# EAGLE design SparkFun_XBee_Development_Board (EAGLE 9.6.2)
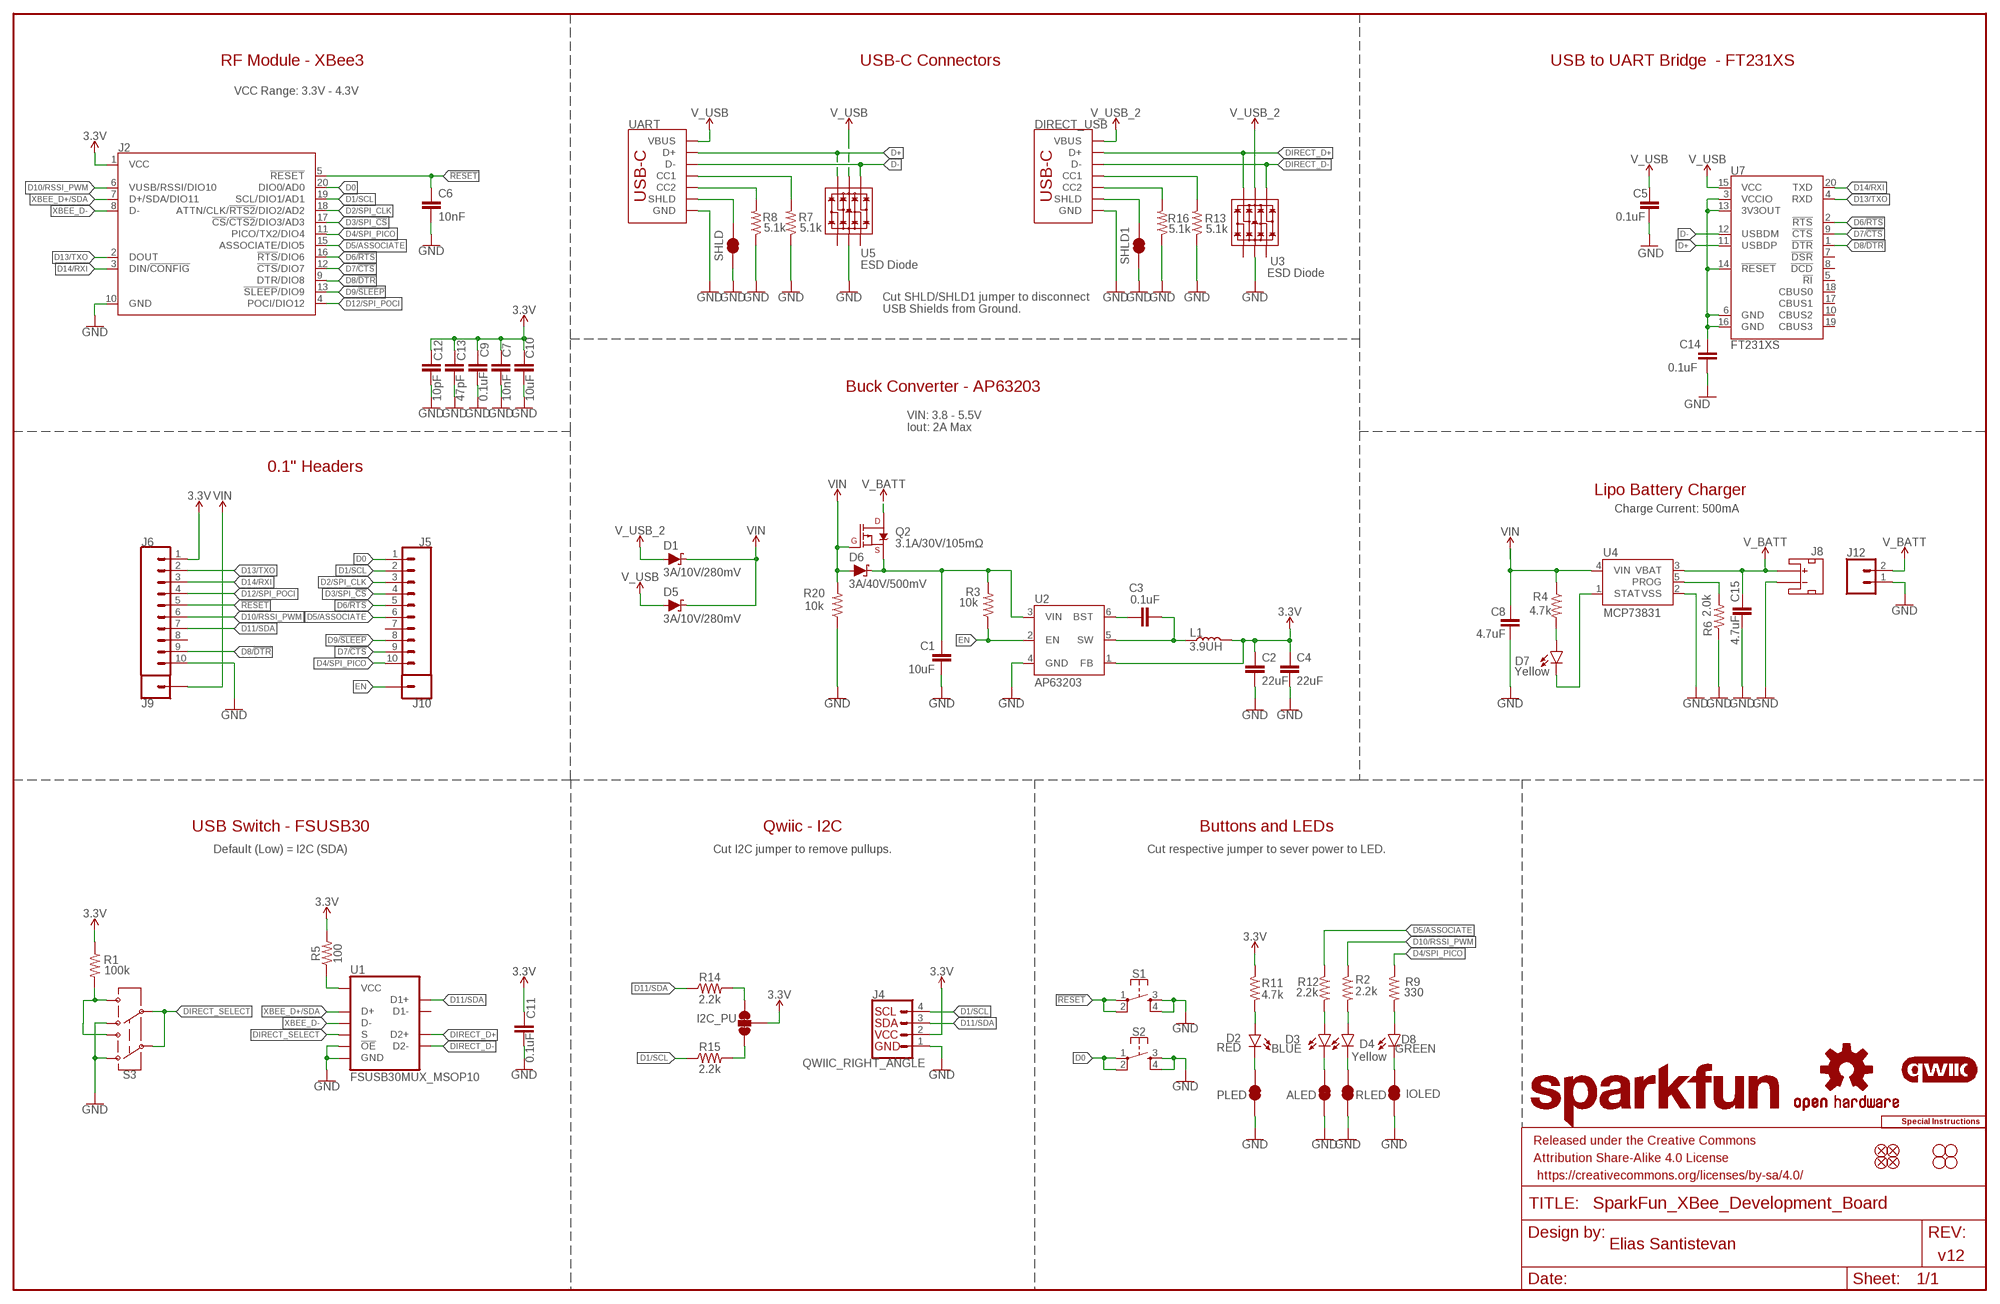
[diagram p0: schematic, sheet 1]

## Parts
ALED  JUMPER-SMT_2_NC_TRACE_SILK  [SMT-JUMPER_2_NC_TRACE_SILK]
C1  10uF  10UF-1210-50V-20%  [1210]
C2  22uF  22UF-0603-6.3V-20%  [0603]
C3  0.1uF  0.1UF-0603-25V-5%  [0603]
C4  22uF  22UF-0603-6.3V-20%  [0603]
C5  0.1uF  0.1UF-0603-25V-(+80/-20%)  [0603]
C6  10nF  10NF-0603-50V-10%  [0603]
C7  10nF  10NF-0603-50V-10%  [0603]
C8  4.7uF  4.7UF-0603-6.3V-(10%)  [0603]
C9  0.1uF  0.1UF-0603-25V-(+80/-20%)  [0603]
C10  10uF  10UF-0603-6.3V-20%  [0603]
C11  0.1uF  0.1UF-0603-25V-(+80/-20%)  [0603]
C12  10pF  10PF-0603-50V-5%  [0603]
C13  47pF  47PF-0603-50V-5%  [0603]
C14  0.1uF  0.1UF-0603-25V-(+80/-20%)  [0603]
C15  4.7uF  4.7UF-0603-35V-(20%)  [0603]
D1  3A/10V/280mV  DIODE-SCHOTTKY-BAT60A  [SOD-323]
D2  RED  LED-RED_0603-KB  [LED-0603]
D3  BLUE  LED-BLUE0603  [LED-0603]
D4  Yellow  LED-YELLOW0603  [LED-0603]
D5  3A/10V/280mV  DIODE-SCHOTTKY-BAT60A  [SOD-323]
D6  3A/40V/500mV  DIODE-SCHOTTKY-B340A  [SMA-DIODE]
D7  Yellow  LED-YELLOW0603  [LED-0603]
D8  GREEN  LED-GREEN0603  [LED-0603]
DIRECT_USB  USB Female Type C Connector  USB_C_4-LAYER-ISOLATED  [USB-C-16P-4LAYER-ISOLATED]
FD1  FIDUCIAL1X2  [FIDUCIAL-1X2]
FD2  FIDUCIAL1X2  [FIDUCIAL-1X2]
FD3  FIDUCIAL1X2  [FIDUCIAL-1X2]
FD4  FIDUCIAL1X2  [FIDUCIAL-1X2]
FRAME1  FRAME-LEDGER  [CREATIVE_COMMONS]
H1  STAND-OFFTIGHT  [STAND-OFF-TIGHT]
H2  STAND-OFFTIGHT  [STAND-OFF-TIGHT]
H3  STAND-OFFTIGHT  [STAND-OFF-TIGHT]
H4  STAND-OFFTIGHT  [STAND-OFF-TIGHT]
I2C_PU  JUMPER-SMT_3_2-NC_TRACE_SILK  [SMT-JUMPER_3_2-NC_TRACE_SILK]
IOLED  JUMPER-SMT_2_NC_TRACE_SILK  [SMT-JUMPER_2_NC_TRACE_SILK]
J2  XBEE_UPDATEXBEE_SMD  [XBEE3-SMD]
J4  QWIIC_RIGHT_ANGLE  QWIIC_CONNECTORJS-1MM  [JST04_1MM_RA]
J5  CONN_10NO_SILK_PTH_FEMALE  [1X10_NO_SILK]
J6  CONN_10NO_SILK_PTH_FEMALE  [1X10_NO_SILK]
J8  JST_2MM_MALE  [JST-2-SMD]
J9  CONN_01PTH_NO_SILK_STAND  [1X01_NO_SILK_STAND]
J10  CONN_01PTH_NO_SILK_STAND  [1X01_NO_SILK_STAND]
J12  CONN_021X02_NO_SILK  [1X02_NO_SILK]
L1  3.9UH  [INDUCTOR_3.9UH]
LOGO1  SFE_LOGO_NAME.2_INCH  [SFE_LOGO_NAME_.2]
LOGO2  OSHW-LOGOS  [OSHW-LOGO-S]
LOGO3  QWIIC_LOGO_5MM  [QWIIC_5MM]
LOGO5  SPECIAL_INSTRUCTIONS-ORDERING  [ORDERING_INSTRUCTIONS]
PLED  JUMPER-SMT_2_NC_TRACE_SILK  [SMT-JUMPER_2_NC_TRACE_SILK]
Q2  3.1A/30V/105mΩ  MOSFET_PCH-DMG2307L  [SOT23-3]
R1  100k  100KOHM-0603-1/10W-1%  [0603]
R2  2.2k  2.2KOHM-0603-1/10W-1%  [0603]
R3  10k  10KOHM-0603-1/10W-1%  [0603]
R4  4.7k  4.7KOHM-0603-1/10W-1%  [0603]
R5  100  100OHM-0603-1/10W-1%  [0603]
R6  2.0k  2.0KOHM-0603-1/10W-5%  [0603]
R7  5.1k  5.1KOHM5.1KOHM-0603-1/10W-1%  [0603]
R8  5.1k  5.1KOHM5.1KOHM-0603-1/10W-1%  [0603]
R9  330  330OHM-0603-1/10W-1%  [0603]
R11  4.7k  4.7KOHM-0603-1/10W-1%  [0603]
R12  2.2k  2.2KOHM-0603-1/10W-1%  [0603]
R13  5.1k  5.1KOHM5.1KOHM-0603-1/10W-1%  [0603]
R14  2.2k  2.2KOHM-0603-1/10W-1%  [0603]
R15  2.2k  2.2KOHM-0603-1/10W-1%  [0603]
R16  5.1k  5.1KOHM5.1KOHM-0603-1/10W-1%  [0603]
R20  10k  10KOHM-0603-1/10W-1%  [0603]
RLED  JUMPER-SMT_2_NC_TRACE_SILK  [SMT-JUMPER_2_NC_TRACE_SILK]
S1  MOMENTARY-SWITCH-SPST-2-SMD-5.2MM-TALL  [TACTILE_SWITCH_SMD_5.2MM]
S2  MOMENTARY-SWITCH-SPST-2-SMD-5.2MM-TALL  [TACTILE_SWITCH_SMD_5.2MM]
S3  SWITCH-DPDT-SMD-AYZ0202  [SWITCH_DPDT_SMD_AYZ0202]
SHLD  JUMPER-SMT_2_NC_TRACE_SILK  [SMT-JUMPER_2_NC_TRACE_SILK]
SHLD1  JUMPER-SMT_2_NC_TRACE_SILK  [SMT-JUMPER_2_NC_TRACE_SILK]
U1  FSUSB30MUX_MSOP10  [MSOP10]
U2  AP63203  [SOT23-6]
U3  ESD Diode  TVS_DIODE_ARRAY_DT1042-04SO-7  [SOT-23-6]
U4  MCP73831  [SOT23-5]
U5  ESD Diode  TVS_DIODE_ARRAY_DT1042-04SO-7  [SOT-23-6]
U7  FT231XS  [SSOP20_L]
UART  USB Female Type C Connector  USB_C_4-LAYER-ISOLATED  [USB-C-16P-4LAYER-ISOLATED]

## Nets
3.3V: C2.1 C4.1 C7.1 C9.1 C10.1 C11.1 C12.1 C13.1 I2C_PU.2 J2.1(VCC) J4.2 J6.1 L1.P$2 R1.1 R5.2 R11.1 U2.1(FB)
!RESET!: C6.1 J2.5(!RESET!) J6.5 S1.1 S1.2
ALED: ALED.2 D3.C
D0: J2.20(DIO0/AD0) J5.1 S2.1 S2.2
D1/SCL: J2.19(SCL/DIO1/AD1) J4.4 J5.2 R15.1
D2/SPI_CLK: J2.18(ATTN/CLK/!RTS2!/DIO2/AD2) J5.3
D3/SPI_!CS!: J2.17(!CS!/!CTS2!/DIO3/AD3) J5.4
D4/SPI_PICO: J2.11(PICO/TX2/DIO4) J5.10 R9.1
D5/ASSOCIATE: J2.15(ASSOCIATE/DIO5) J5.6 R12.1
D6/!RTS!: J2.16(!RTS!/DIO6) J5.5 U7.2(!RTS)
D7/!CTS!: J2.12(!CTS!/DIO7) J5.9 U7.9(!CTS)
D8/!DTR!: J2.9(DTR/DIO8) J6.9 U7.1(!DTR)
D9/!SLEEP!: J2.13(!SLEEP!/DIO9) J5.8
D10/RSSI_PWM: J2.6(VUSB/RSSI/DIO10) J6.6 R2.1
D11/SDA: J4.3 J6.7 R14.1 U1.2(D1+)
D12/SPI_POCI: J2.4(POCI/DIO12) J6.4
D13/TXO: J2.2(DOUT) J6.2 U7.4(RXD)
D14/RXI: J2.3(DIN/!CONFIG!) J6.3 U7.20(TXD)
D+ [Diff pairs]: U5.6(IO4) U7.11(USBDP) UART.A6(D+) UART.B6(D+)
D- [Diff pairs]: U5.4(IO3) U7.12(USBDM) UART.A7(D-) UART.B7(D-)
DIRECT_D+ [Diff pairs]: DIRECT_USB.A6(D+) DIRECT_USB.B6(D+) U1.3(D2+) U3.6(IO4)
DIRECT_D- [Diff pairs]: DIRECT_USB.A7(D-) DIRECT_USB.B7(D-) U1.7(D2-) U3.4(IO3)
DIRECT_SELECT: S3.2 S3.5 U1.1(S)
EN: J10.1 R3.1 U2.2(EN)
FIRMWARE: R1.2 S3.1 S3.4
GND: ALED.1 C1.2 C2.2 C4.2 C5.2 C6.2 C7.2 C8.2 C9.2 C10.2 C11.2 C12.2 C13.2 C14.2 C15.2 DIRECT_USB.GND DIRECT_USB.GND2(GND) IOLED.1 J2.10(GND) J4.1 J6.10 J8.1(-) J12.1 PLED.1 R6.1 R7.1 R8.1 R13.1 R16.1 R20.1 RLED.1 S1.3 S1.4 S2.3 S2.4 S3.3 S3.6 SHLD1.1 SHLD.1 U1.5(GND) U1.9(!OE!) U2.4(GND) U3.2(VSS) U4.2(VSS) U5.2(VSS) UART.GND UART.GND2(GND)
IOLED: D8.C IOLED.2
N$1: C3.1 U2.6(BST)
N$2: D4.A R2.2
N$3: R5.1 U1.10(VCC)
N$4: R8.2 UART.B5(CC2)
N$5: R7.2 UART.A5(CC1)
N$6: R6.2 U4.5(PROG)
N$7: D2.A R11.2
N$8: C3.2 L1.P$1 U2.5(SW)
N$9: D7.C U4.1(STAT)
N$10: D7.A R4.2
N$11: I2C_PU.3 R14.2
N$12: D3.A R12.2
N$13: I2C_PU.1 R15.2
N$14: DIRECT_USB.B5(CC2) R16.2
N$15: C1.1 D6.C Q2.2(S) R3.2 U2.3(VIN)
N$16: DIRECT_USB.A5(CC1) R13.2
N$17: D8.A R9.2
N$18: C14.1 U7.3(VCCIO) U7.6(GND) U7.13(3V3OUT) U7.14(!RESET) U7.16(GND)
PLED: D2.C PLED.2
RLED: D4.C RLED.2
SHLD: SHLD.2 UART.SHLD1(SHLD) UART.SHLD2(SHLD) UART.SHLD3(SHLD) UART.SHLD4(SHLD) UART.SHLD5(SHLD) UART.SHLD6(SHLD) UART.SHLD7(SHLD) UART.SHLD8(SHLD)
SHLD1: DIRECT_USB.SHLD1(SHLD) DIRECT_USB.SHLD2(SHLD) DIRECT_USB.SHLD3(SHLD) DIRECT_USB.SHLD4(SHLD) DIRECT_USB.SHLD5(SHLD) DIRECT_USB.SHLD6(SHLD) DIRECT_USB.SHLD7(SHLD) DIRECT_USB.SHLD8(SHLD) SHLD1.2
V_BATT [POWER]: C15.1 J8.2(+) J12.2 Q2.3(D) U4.3(VBAT)
V_USB: C5.1 D5.A U5.5(VCC) U7.15(VCC) UART.VBUS1(VBUS) UART.VBUS2(VBUS)
V_USB_2: D1.A DIRECT_USB.VBUS1(VBUS) DIRECT_USB.VBUS2(VBUS) U3.5(VCC)
VIN: C8.1 D1.C D5.C D6.A J9.1 Q2.1(G) R4.1 R20.2 U4.4(VIN)
XBEE_D+/SDA [Diff pairs]: J2.7(D+/SDA/DIO11) U1.4(D+)
XBEE_D- [Diff pairs]: J2.8(D-) U1.6(D-)
Unconnected: J5.7 J6.8 J8.NC1(PAD1) J8.NC2(PAD2) U1.8(D1-) U3.1(IO1) U3.3(IO2) U5.1(IO1) U5.3(IO2) U7.5(!RI) U7.7(!DSR) U7.8(!DCD) U7.10(CBUS2) U7.17(CBUS1) U7.18(CBUS0) U7.19(CBUS3)

## Notes on the sheet
- RF Module - XBee3 | USB-C Connectors | USB to UART Bridge  - FT231XS
- VCC Range: 3.3V - 4.3V
- Cut SHLD/SHLD1 jumper to disconnect
  USB Shields from Ground.
- Buck Converter - AP63203
- VIN: 3.8 - 5.5V
  Iout: 2A Max
- 0.1" Headers
- Lipo Battery Charger
- Charge Current: 500mA
- USB Switch - FSUSB30 | Qwiic - I2C | Buttons and LEDs
- Default (Low) = I2C (SDA) | Cut I2C jumper to remove pullups. | Cut respective jumper to sever power to LED.
- Elias Santistevan
- v12

## Library data of the parts
ALED IOLED PLED RLED SHLD SHLD1 = SparkFun-Jumpers:JUMPER-SMT_2_NC_TRACE: Normally closed trace jumper This jumper has a trace between two pads so it's normally closed (NC). Use a razor knife to open the connection. For best results follow the IPC guidelines for cutting traces: Cutout at least 0.063 mm (0.005 in). Remove all loose material to clean up the cut area. Seal the cut with an approved epoxy. Reapply solder to reclose the connection.
C1 = SparkFun-Capacitors:10UF: 10.0µF ceramic capacitors A capacitor is a passive two-terminal electrical component used to store electrical energy temporarily in an electric field.; PROD_ID: CAP-09824
C2 C4 = SparkFun-Capacitors:22UF: 22µF ceramic capacitors A capacitor is a passive two-terminal electrical component used to store electrical energy temporarily in an electric field.; PROD_ID: CAP-14464
C3 = SparkFun-Capacitors:0.1UF: 0.1µF ceramic capacitors A capacitor is a passive two-terminal electrical component used to store electrical energy temporarily in an electric field.; PROD_ID: CAP-08604
C5 C9 C11 C14 = SparkFun-Capacitors:0.1UF: 0.1µF ceramic capacitors A capacitor is a passive two-terminal electrical component used to store electrical energy temporarily in an electric field.; PROD_ID: CAP-00810
C6 C7 = SparkFun-Capacitors:10NF: 0.01uF/10nF/10,000pF ceramic capacitors A capacitor is a passive two-terminal electrical component used to store electrical energy temporarily in an electric field. CAP-09321; PROD_ID: CAP-00867
C8 = SparkFun-Capacitors:4.7UF: 4.7µF ceramic capacitors A capacitor is a passive two-terminal electrical component used to store electrical energy temporarily in an electric field.; PROD_ID: CAP-08280
C10 = SparkFun-Capacitors:10UF: 10.0µF ceramic capacitors A capacitor is a passive two-terminal electrical component used to store electrical energy temporarily in an electric field.; PROD_ID: CAP-11015
C12 = SparkFun-Capacitors:10PF: 10pF ceramic capacitors A capacitor is a passive two-terminal electrical component used to store electrical energy temporarily in an electric field.; PROD_ID: CAP-11812
C13 = SparkFun-Capacitors:47PF: 47pF ceramic capacitors A capacitor is a passive two-terminal electrical component used to store electrical energy temporarily in an electric field.; PROD_ID: CAP-08913
C15 = SparkFun-Capacitors:4.7UF: 4.7µF ceramic capacitors A capacitor is a passive two-terminal electrical component used to store electrical energy temporarily in an electric field.; PROD_ID: CAP-14106
D1 D5 = SparkFun-DiscreteSemi:DIODE-SCHOTTKY: Schottky diode A Schottky diode is a semiconductor diode which has a low forward voltage drop and a very fast switching action.; PROD_ID: DIO-14072
D2 = SparkFun-LED:LED-RED: Red SMD LED Used in manufacturing of most products at SparkFun Packages: 0603 - KB - KingBright (DIO-17976) SMD 0603 package [Datasheet] <https://www.kingbrightusa.com/images/catalog/SPEC/APT1608SURCK.pdf> 0603 - (DIO-00819, has gone EOL) SMD 0603 package 0603 SMART - SMD 0603 SMART package ( more efficient and expensive)[Product Link] <http://www.osram-os.com/Graphics/XPic2/00077099_0.pdf> 1206 - SMD1206 package [Product Link] <https://www.sparkfun.com/datasheets/DevTools/LilyPad/Q150OVS4.pdff> SparkFun Products: Pro Mini 328 -5V <https://www.sparkfun.com/products/821> RedBoard <https://www.sparkfun.com/products/12757> IOIO-OTG <https://www.sparkfun.com/products/13613>; PROD_ID: DIO-17976
D3 = SparkFun-LED:LED-BLUE: Blue SMD LED Used in manufacturing of various products at SparkFun Packages: 0603 - SMD 0603 package [Product Link] <http://www.digikey.com/product-detail/en/SMLE12BC7TT86/511-1589-2-ND/1641808> 1206 - SMD1206 package [Product Link] <http://www.digikey.com/product-detail/en/lite-on-inc/LTST-C150TBKT/160-1643-1-ND/573584> SparkFun Products: ESP8266 Thing-Dev Board <https://www.sparkfun.com/products/13711> RedBoard <https://www.sparkfun.com/products/12757>; PROD_ID: DIO-08575
D4 D7 = SparkFun-LED:LED-YELLOW: Yellow SMD LED Used in manufacturing several products at SparkFun. Packages: 0603 - SMD 0603 package[Product Link] <http://www.kingbrightusa.com/product.asp?catalog_name=LED&product_id=APT1608SYCK> 0603 -SMART - SMART SMD 0603 package (more efficient/more expensive) [Product Link] <http://www.osram-os.com/osram_os/en/products/product-catalog/led-light-emitting-diodes/smartled-0603/ly-l29k/index.jsp> LilyPad - SMD1206 package[Product Datasheet] <https://www.sparkfun.com/datasheets/DevTools/LilyPad/Q150YUS4.pdf> SparkFun Products: Blynk Board <https://www.sparkfun.com/products/13794> IOIO-OTG <https://www.sparkfun.com/products/13613> XBee Explorer Serial <https://www.sparkfun.com/products/13225>; PROD_ID: DIO-09003
D6 = SparkFun-DiscreteSemi:DIODE-SCHOTTKY: Schottky diode A Schottky diode is a semiconductor diode which has a low forward voltage drop and a very fast switching action.; PROD_ID: DIO-09886
D8 = SparkFun-LED:LED-GREEN: Green SMD LED Used in manufacturing of various products at SparkFun Packages: 0603 - SMD 0603 package [Product Link] <http://www.futureelectronics.com/en/technologies/semiconductors/optoelectronics/leds/Pages/9894312-LTST-C190GKT.aspx?CrossPart=HSMG-C190&IM=0> LilyPad 1206 - SMD1206 LilyPad package [Product Link] <http://www.futureelectronics.com/en/Technologies/Product.aspx?ProductID=IN150NGHARVATEKCORPORATION2049943&IM=0> 1206 - SMD1206 package [Product Link] <http://www.futureelectronics.com/en/technologies/semiconductors/optoelectronics/leds/Pages/8315665-LTST-C150KGKT.aspx?IM=0> 1206 Bottom Mount -SMD 1206 Bottom Mount [Product Link] <http://www.digikey.com/product-detail/en/lite-on-inc/LTST-C230KGKT/160-1456-1-ND/386854> SparkFun Products: Pro Mini 328 -5V <https://www.sparkfun.com/products/821> RedBoard <https://www.sparkfun.com/products/12757> MP3 Trigger <https://www.sparkfun.com/products/13720> Makey Makey <https://www.sparkfun.com/products/11076>; PROD_ID: DIO-00821
DIRECT_USB UART = SparkFun-Connectors:USB_C: USB Type C 16Pin Connector Super Speed pins not available on the 16-pin purely SMD connector so this part is best for USB 2.0 implementations. D1 and D2 are tied together enabling D+/- no matter which way the cable is plugged into the connector. The two channel configuration pins (CC1/2) are exposed. These are normally connected to ground via 5.1k resistors but can be reconfigured for high current/high power applications. **4-LAYER BOARD WARNING!!** If designing 4-layer board, make sure to select the variant _4-LAYER-ISOLATED. The linked footprint (USB-C-16-4LAYER-ISOLATED) includes some very necessary cutout polygons in the inner layers (2 and 15). This prevents the PTH mounting shield legs on the USB connector from electrically connecting any other polygons on the inner layers (usually VCC and GND).; PROD_ID: CONN-14122
FD1-FD4 = SparkFun-Aesthetics:FIDUCIAL: Fiducial Alignment Points Point-of-reference for pick-and-place machines and other optical instruments.
FRAME1 = SparkFun-Aesthetics:FRAME-LEDGER: Schematic Frame - Ledger Standard 11x14 US Ledger frame
H1-H4 = SparkFun-Hardware:STAND-OFF: Stand Off Drill holes for mechanically mounting via screws, standoffs, etc. Note: Use the keepout ring to avoid running the screw head into surrounding components. Variant Overviews STAND-OFF - Mechanical footprint for a #4 phillips button head screw. STAND-OFF-TIGHT - Mechanical footprint for a #4 phillips button head screw, Example SparkFun Products Screw - Phillips Head (1/4", 4-40, 10 pack) <https://www.sparkfun.com/products/10453> (PRT-10453) Screw - Phillips Head (1/2", 4-40, 10 pack) <https://www.sparkfun.com/products/10452> (PRT-10452) Screw - Phillips Head (3/4", 4-40, 10 pack) <https://www.sparkfun.com/products/10451> (PRT-10451) Screw - Phillips Head (1", 4-40, 10 pack) <https://www.sparkfun.com/products/10450> (PRT-10450)
I2C_PU = SparkFun-Jumpers:JUMPER-SMT_3_2-NC_TRACE: Normally closed trace jumper (2 of 2 connections) This jumper has a trace between all three pads so they are normally closed (NC). Use a razor knife to open the connection(s). For best results follow the IPC guidelines for cutting traces: Cutout at least 0.063 mm (0.005 in). Remove all loose material to clean up the cut area. Seal the cut with an approved epoxy. Reapply solder to reclose the connection(s).
J2 = xbee_smart_modem:XBEE_UPDATE: XBee 3 Cat 1 Smart Modem
J4 = SparkFun-Connectors:QWIIC_CONNECTOR: SparkFun I2C Standard Qwiic Connector An SMD 1mm pitch JST connector makes it easy and quick (get it? Qwiic?) to connect I2C devices to each other. The Qwiic system <http://www.sparkfun.com/qwiic> enables fast and solderless connection between popular platforms and various sensors and actuators. We carry 200mm <https://www.sparkfun.com/products/14204>, 100mm <https://www.sparkfun.com/products/14205>, 50mm <https://www.sparkfun.com/products/14206>, and breadboard friendly <https://www.sparkfun.com/products/14207> Qwiic cables. We also offer 10 pcs strips <https://www.sparkfun.com/products/14323> the SMD connectors.; PROD_ID: CONN-13694
J5 J6 = SparkFun-Connectors:CONN_10: Multi connection point. Often used as Generic Header-pin footprint for 0.1 inch spaced/style header connections On any of the 0.1 inch spaced packages, you can populate with these: Break Away Headers - Straight <https://www.sparkfun.com/products/116> (PRT-00116) Break Away Male Headers - Right Angle <https://www.sparkfun.com/products/553> (PRT-00553) Female Headers <https://www.sparkfun.com/products/115> (PRT-00115) Break Away Headers - Machine Pin <https://www.sparkfun.com/products/117> (PRT-00117) Break Away Female Headers - Swiss Machine Pin <https://www.sparkfun.com/products/743> (PRT-00743) Arduino Stackable Header - 10 Pin <https://www.sparkfun.com/products/11376> (PRT-11376) For SCREWTERMINALS and SPRING TERMINALS visit here: Screw Terimnals on SparkFun.com <https://www.sparkfun.com/search/results?term=Screw+Terminals> (5mm/3.5mm/2.54mm spacing) This device is also useful as a general connection point to wire up your design to another part of your project. Our various solder wires solder well into these plated through hole pads. Hook-Up Wire - Assortment (Stranded, 22 AWG) <https://www.sparkfun.com/products/11375> (PRT-11375) Hook-Up Wire - Assortment (Solid Core, 22 AWG) <https://www.sparkfun.com/products/11367> (PRT-11367) View the entire wire category on our website here <https://www.sparkfun.com/categories/141> Special notes: Molex polarized connector foot print use with SKU : PRT-08231 with associated crimp pins and housings. 1MM SMD Version SKU: PRT-10208 NOTES ON THE VARIANTS LOCK and LOCK_LONGPADS... This footprint was designed to help hold the alignment of a through-hole component (i.e. 6-pin header) while soldering it into place. You may notice that each hole has been shifted either up or down by 0.005 of an inch from it's more standard position (which is a perfectly straight line). This slight alteration caused the pins (the squares in the middle) to touch the edges of the holes. Because they are alternating, it causes a "brace" to hold the component in place. 0.005 has proven to be the perfect amount of "off-center" position when using our standard breakaway headers. Although looks a little odd when you look at the bare footprint, once you have a header in there, the alteration is very hard to notice. Also,if you push a header all the way into place, it is covered up entirely on the bottom side.
J8 = SparkFun-Connectors:JST_2MM_MALE: JST 2MM MALE RA CONNECTOR Two pin, compact surface mount connector. Commonly used as a battery input connection point. We really like the solid locking feeling and high current rating on these small connectors. We use these all the time as battery connectors. Mates to single-cell LiPo batteries. Here is the connector we sell at SparkFun: JST Right Angle Connector - White <https://www.sparkfun.com/products/8612> (PRT-08612) Datasheet <http://www.sparkfun.com/datasheets/Prototyping/Connectors/JST-Horizontal.pdf> It was used on these SparkFun products: SparkFun MOSFET Power Controller <https://www.sparkfun.com/products/11214> (PRT-11214) SparkFun Battery Babysitter - LiPo Battery Manager <https://www.sparkfun.com/products/13777> (PRT-13777) And many, many others that required a lipo battery connection.; PROD_ID: CONN-11443; SF_ID: PRT-08612
J9 J10 = SparkFun-Connectors:CONN_01: Single connection point. Often used as Generic Header-pin footprint for 0.1 inch spaced/style header connections On any of the 0.1 inch spaced packages, you can populate with these: Break Away Headers - Straight <https://www.sparkfun.com/products/116> (PRT-00116) Break Away Male Headers - Right Angle <https://www.sparkfun.com/products/553> (PRT-00553) Female Headers <https://www.sparkfun.com/products/115> (PRT-00115) Break Away Headers - Machine Pin <https://www.sparkfun.com/products/117> (PRT-00117) Break Away Female Headers - Swiss Machine Pin <https://www.sparkfun.com/products/743> (PRT-00743) This device is also useful as a general connection point to wire up your design to another part of your project. Our various solder wires solder well into these plated through hole pads. Hook-Up Wire - Assortment (Stranded, 22 AWG) <https://www.sparkfun.com/products/11375> (PRT-11375) Hook-Up Wire - Assortment (Solid Core, 22 AWG) <https://www.sparkfun.com/products/11367> (PRT-11367) View the entire wire category on our website here <https://www.sparkfun.com/categories/141> Special notes: SMTSO-256-ET is a "flush mount" nut for a 4-40 screw. We mostly use this on specialty testbeds; it is a nice way to connect hardware to your PCB at an adjustable hieght. Also note, the SNAP packages are for using a snappable style connector. We sell a baggie of snaps and they are also used on two LilyPad designs: Snap Assortment - 30 pack (male and female) <https://www.sparkfun.com/products/11347> (DEV-11347) LilyPad Arduino SimpleSnap <https://www.sparkfun.com/products/10941> (DEV-10941) LilyPad SimpleSnap Protoboard <https://www.sparkfun.com/products/10940> (DEV-10940)
J12 = SparkFun-Connectors:CONN_02: Multi connection point. Often used as Generic Header-pin footprint for 0.1 inch spaced/style header connections On any of the 0.1 inch spaced packages, you can populate with these: Break Away Headers - Straight <https://www.sparkfun.com/products/116> (PRT-00116) Break Away Male Headers - Right Angle <https://www.sparkfun.com/products/553> (PRT-00553) Female Headers <https://www.sparkfun.com/products/115> (PRT-00115) Break Away Headers - Machine Pin <https://www.sparkfun.com/products/117> (PRT-00117) Break Away Female Headers - Swiss Machine Pin <https://www.sparkfun.com/products/743> (PRT-00743) For SCREWTERMINALS and SPRING TERMINALS visit here: Screw Terimnals on SparkFun.com <https://www.sparkfun.com/search/results?term=Screw+Terminals> (5mm/3.5mm/2.54mm spacing) This device is also useful as a general connection point to wire up your design to another part of your project. Our various solder wires solder well into these plated through hole pads. Hook-Up Wire - Assortment (Stranded, 22 AWG) <https://www.sparkfun.com/products/11375> (PRT-11375) Hook-Up Wire - Assortment (Solid Core, 22 AWG) <https://www.sparkfun.com/products/11367> (PRT-11367) View the entire wire category on our website here <https://www.sparkfun.com/categories/141> Special notes: Molex polarized connector foot print use with: PRT-08233 with associated crimp pins and housings. 2.54_SCREWTERM for use with PRT-10571. 3.5mm Screw Terminal footprints for PRT-08084 5mm Screw Terminal footprints for use with PRT-08432
L1 = SparkFun-Coils:3.9UH: Würth's Electronik 3.9uH Inductor Characteristics 3.9uH 2.4A Current Rating 2.8A Saturation Inductance Frequency: 100kHzd AEC-Q200 Certified 5mm x 5mm Package 30% tolerance; PROD_ID: NDUC-18014
LOGO1 = SparkFun-Aesthetics:SFE_LOGO_NAME: SparkFun Font Logo This is the SparkFun name logo. The logo on the schematic will always be the same size; the package variant is the height of the flame part of the logo (or the height the flame would be, if it were drawn). Default layer for the logo on the board is tSilk.
LOGO2 = SparkFun-Aesthetics:OSHW-LOGO: Open-Source Hardware (OSHW) Logo This logo indicates the piece of hardware it is found on incorporates a OSHW license and/or adheres to the definition of open source hardware found here: http://freedomdefined.org/OSHW
LOGO3 = SparkFun-Aesthetics:QWIIC_LOGO: Qwiic Logos for placement on schematic and PCB. The 5.5mm silk logo is best for placing next to Qwiic connector.
LOGO5 = SparkFun-Aesthetics:SPECIAL_INSTRUCTIONS: Special Ordering/Production Instructions Alert Symbol for special PCB ordering instructions or unique production process warnings. Ordering Instructions Production Instructions Types of information that should be added to box: Copper weight Soldermask color Silk color PCB thickness Number of layers PCB Standard: 1.6mm FR4 1 oz copper immersion silver plating red soldermask white silkscreen Types of information that should be added to box: Special wash requirements Depaneling instructions Humidification Glue curing Default text settings: 0.07 inch 9% ratio 50% line distance
Q2 = SparkFun-DiscreteSemi:MOSFET_PCH: P-channel MOSFETs Voltage controlled devices that allow control of high current outputs. SparkFun Products: SparkFun ESP32 Thing <https://www.sparkfun.com/products/13907> SparkFun ESP8266 Thing <https://www.sparkfun.com/products/13231> SparkFun Pi Servo HAT V2 <https://www.sparkfun.com/products/15316> DMG2305UX-7 (20V/4.2A/SOT23-3); PROD_ID: TRANS-11308
R1 = SparkFun-Resistors:100KOHM: 100kΩ resistor A resistor is a passive two-terminal electrical component that implements electrical resistance as a circuit element. Resistors act to reduce current flow, and, at the same time, act to lower voltage levels within circuits. - Wikipedia; PROD_ID: RES-07828
R2 R12 R14 R15 = SparkFun-Resistors:2.2KOHM: 2.2kΩ resistor A resistor is a passive two-terminal electrical component that implements electrical resistance as a circuit element. Resistors act to reduce current flow, and, at the same time, act to lower voltage levels within circuits. - Wikipedia; PROD_ID: RES-08272
R3 R20 = SparkFun-Resistors:10KOHM: 10kΩ resistor A resistor is a passive two-terminal electrical component that implements electrical resistance as a circuit element. Resistors act to reduce current flow, and, at the same time, act to lower voltage levels within circuits. - Wikipedia; PROD_ID: RES-00824
R4 R11 = SparkFun-Resistors:4.7KOHM: 4.7kΩ resistor A resistor is a passive two-terminal electrical component that implements electrical resistance as a circuit element. Resistors act to reduce current flow, and, at the same time, act to lower voltage levels within circuits. - Wikipedia; PROD_ID: RES-07857
R5 = SparkFun-Resistors:100OHM: 100Ω resistor A resistor is a passive two-terminal electrical component that implements electrical resistance as a circuit element. Resistors act to reduce current flow, and, at the same time, act to lower voltage levels within circuits. - Wikipedia; PROD_ID: RES-07863
R6 = SparkFun-Resistors:2.0KOHM: 2kΩ resistor A resistor is a passive two-terminal electrical component that implements electrical resistance as a circuit element. Resistors act to reduce current flow, and, at the same time, act to lower voltage levels within circuits. - Wikipedia; PROD_ID: RES-08296
R7 R8 R13 R16 = SparkFun-Resistors:5.1KOHM; PROD_ID: RES-12083
R9 = SparkFun-Resistors:330OHM: 330Ω resistor A resistor is a passive two-terminal electrical component that implements electrical resistance as a circuit element. Resistors act to reduce current flow, and, at the same time, act to lower voltage levels within circuits. - Wikipedia; PROD_ID: RES-00818
S1 S2 = SparkFun-Switches:MOMENTARY-SWITCH-SPST-2: Momentary Switch (Pushbutton) - SPST - Two Circuits Normally-open (NO) SPST momentary switches (buttons, pushbuttons). Schematic symbol includes two switch circuits. Variants SMD-4.6MMX2.8MM - 4.60mm x 2.80mm Tactile Momentary Button Switch - Used on SparkFun Pro Micro - RP2040 <https://www.sparkfun.com/products/17717> SMD-5.2MM - Mini Pushbutton Switch - SMD <https://www.sparkfun.com/products/8720> - Used on Arduino Pro Mini <https://www.sparkfun.com/products/11114>; PROD_ID: SWCH-14139
S3 = SparkFun-Switches:SWITCH-DPDT: Double-Pole, Double-Throw (DPDT) Switch Double-pole, double-throw switches. Variant Overview PTH-GPI-152-3013 Used on SparkFun Geiger Counter <https://www.sparkfun.com/products/11345> SMD-AY0202 Surface Mount DPDT Switch <https://www.sparkfun.com/products/597> (COM-00597) Used on e.g. LilyPad Arduino USB - ATmega32U4 Board <https://www.sparkfun.com/products/12049>; PROD_ID: SWCH-08179; SF_SKU: COM-00597
U1 = SparkFun-IC-Special-Function:FSUSB30MUX; PROD_ID: IC-15569
U2 = SparkFun-IC-Power:AP63203: Diodes Inc. AP63203 3.8V-32V input 3.3V Buck The AP63200/AP63201/AP63203/AP63205 is a 2A, synchronous buck converter with a wide input voltage range of 3.8V to 32V and fully integrates a 125mΩ high-side power MOSFET and a 68mΩ lowside power MOSFET to provide high-efficiency step-down DC/DC conversion; PROD_ID: VREG-15244
U3 U5 = SparkFun-DiscreteSemi:TVS_DIODE_ARRAY; PROD_ID: IC-13538
U4 = SparkFun-IC-Power:MCP73831: MCP73831T Li-Ion, Li-Pol Controller Miniature single cell, fully integrated Li-Ion, Li-polymer charge management controller Datasheet <http://ww1.microchip.com/downloads/en/DeviceDoc/20001984g.pdf> SparkFun Products: SparkFun ESP32 Thing <https://www.sparkfun.com/products/13907> SparkFun 9DoF Razor IMU M0 <https://www.sparkfun.com/products/14001>; PROD_ID: IC-09995
U7 = SparkFun-IC-Comms:FT231X: FTDI FT231X Full Speed USB to Full-handshake UART This USB2.0 Full Speed IC offers a compact bridge to full handshake UART interfaces. The device is a UART, capable of operating up to 3MBaud, with low power consumption (8mA). The FT231X includes the complete FT-X series feature set and enables USB to be added into a system design quickly and easily over a UART interface. Datasheet <http://cdn.sparkfun.com/datasheets/Components/General%20IC/DS_FT231X.pdf> SparkFun Products SparkFun RedBoard - Programmed with Arduino <https://www.sparkfun.com/products/12757> (DEV-12757) SparkFun XBee Explorer USB <https://www.sparkfun.com/products/11812> (WRL-11812) SparkFun XBee Explorer Dongle <https://www.sparkfun.com/products/11697> (WRL-11697) SparkFun Blynk Board - ESP8266 <https://www.sparkfun.com/products/13794> (WRL-13794) SparkFun ESP8266 Thing - Dev Board <https://www.sparkfun.com/products/13711> (WRL-13711) SparkFun Block for Intel® Edison - Base <https://www.sparkfun.com/products/13045> (DEV-13045) SparkFun RedStick <https://www.sparkfun.com/products/13741> (DEV-13741) SparkFun Beefy 3 - FTDI Basic Breakout <https://www.sparkfun.com/products/13746> (DEV-13746) SparkFun FT231X Breakout <https://www.sparkfun.com/products/11736> (BOB-11736); PROD_ID: IC-11524

## Net classes
1 POWER: width 0.559 mm, drill 0.305 mm
2 Diff pairs: width 0.203 mm, drill 0.305 mm, clearance 0.152 mm

## Board
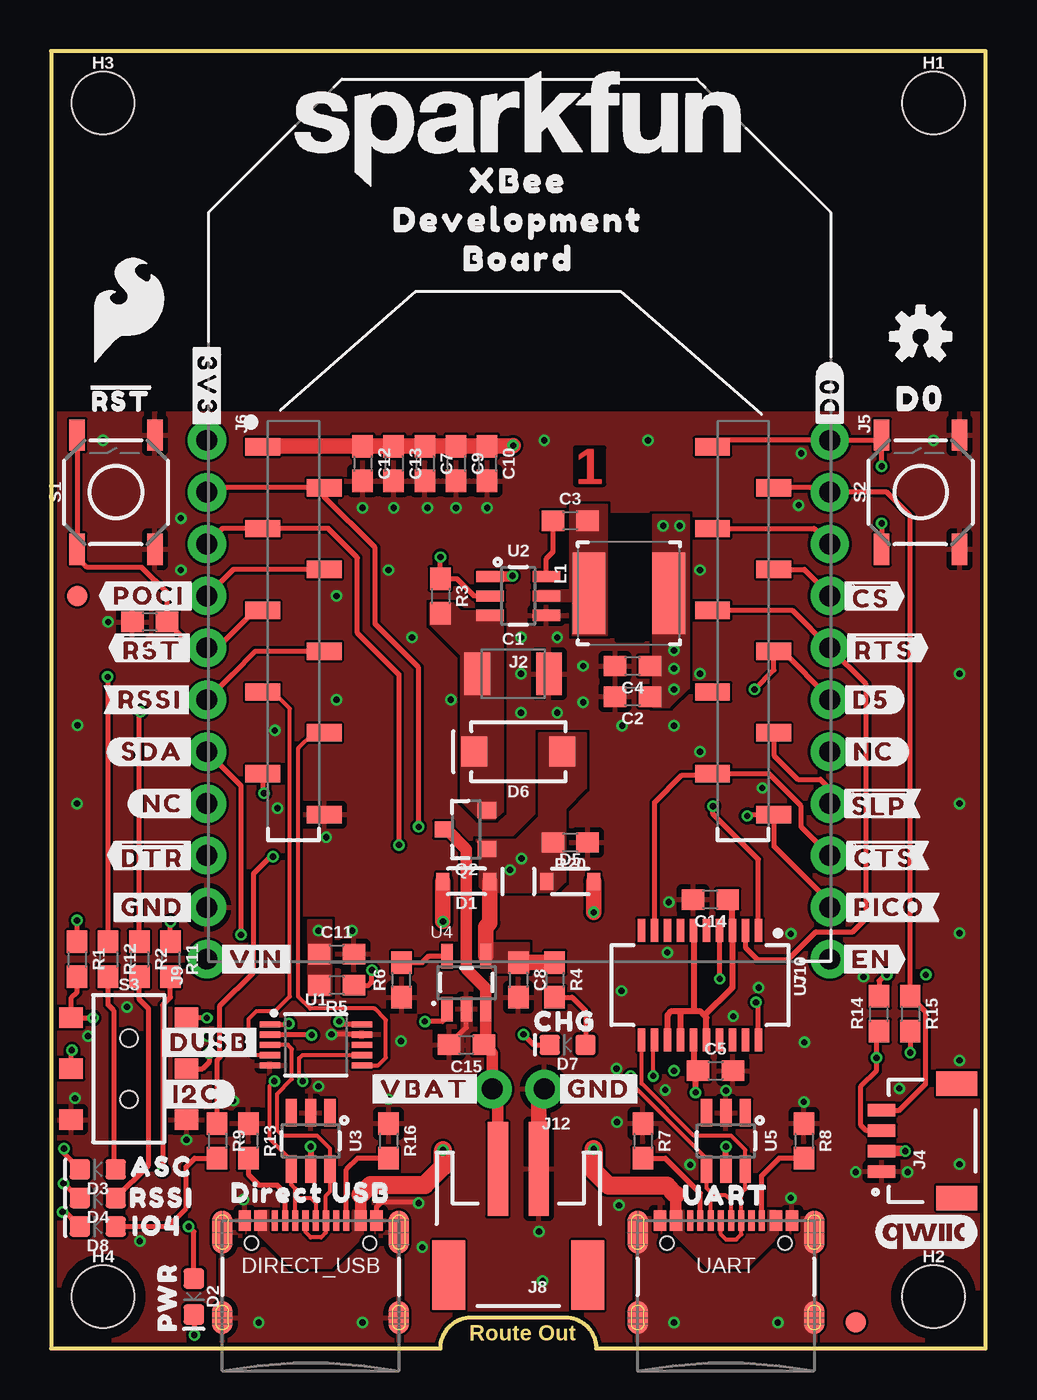
[diagram p1: board, top side]
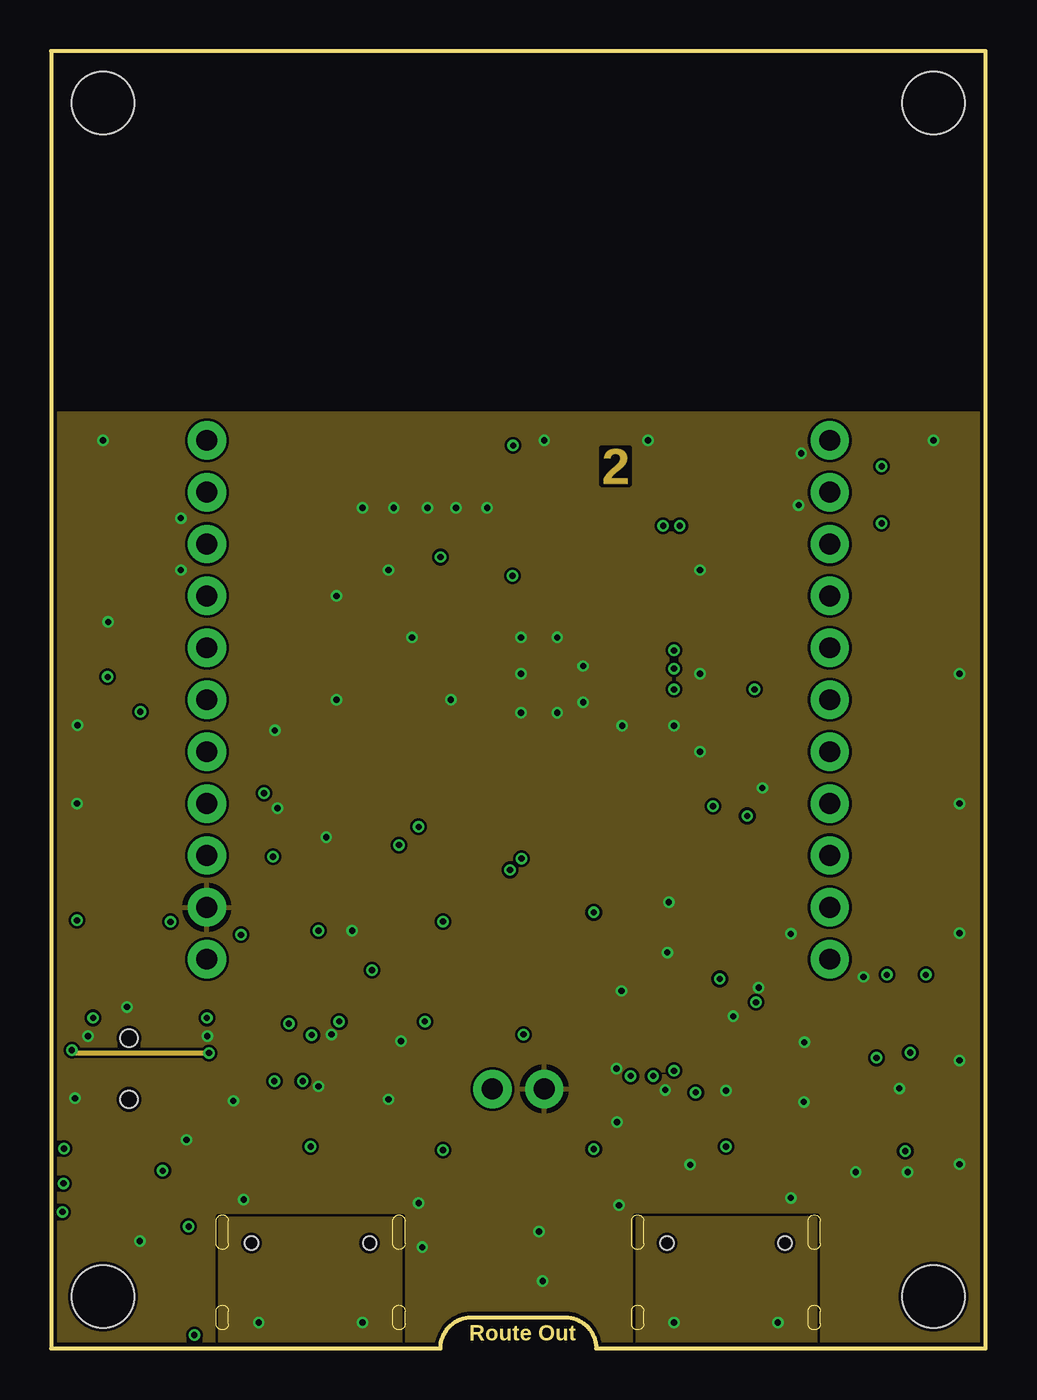
[diagram p2: board, inner layer Route2]
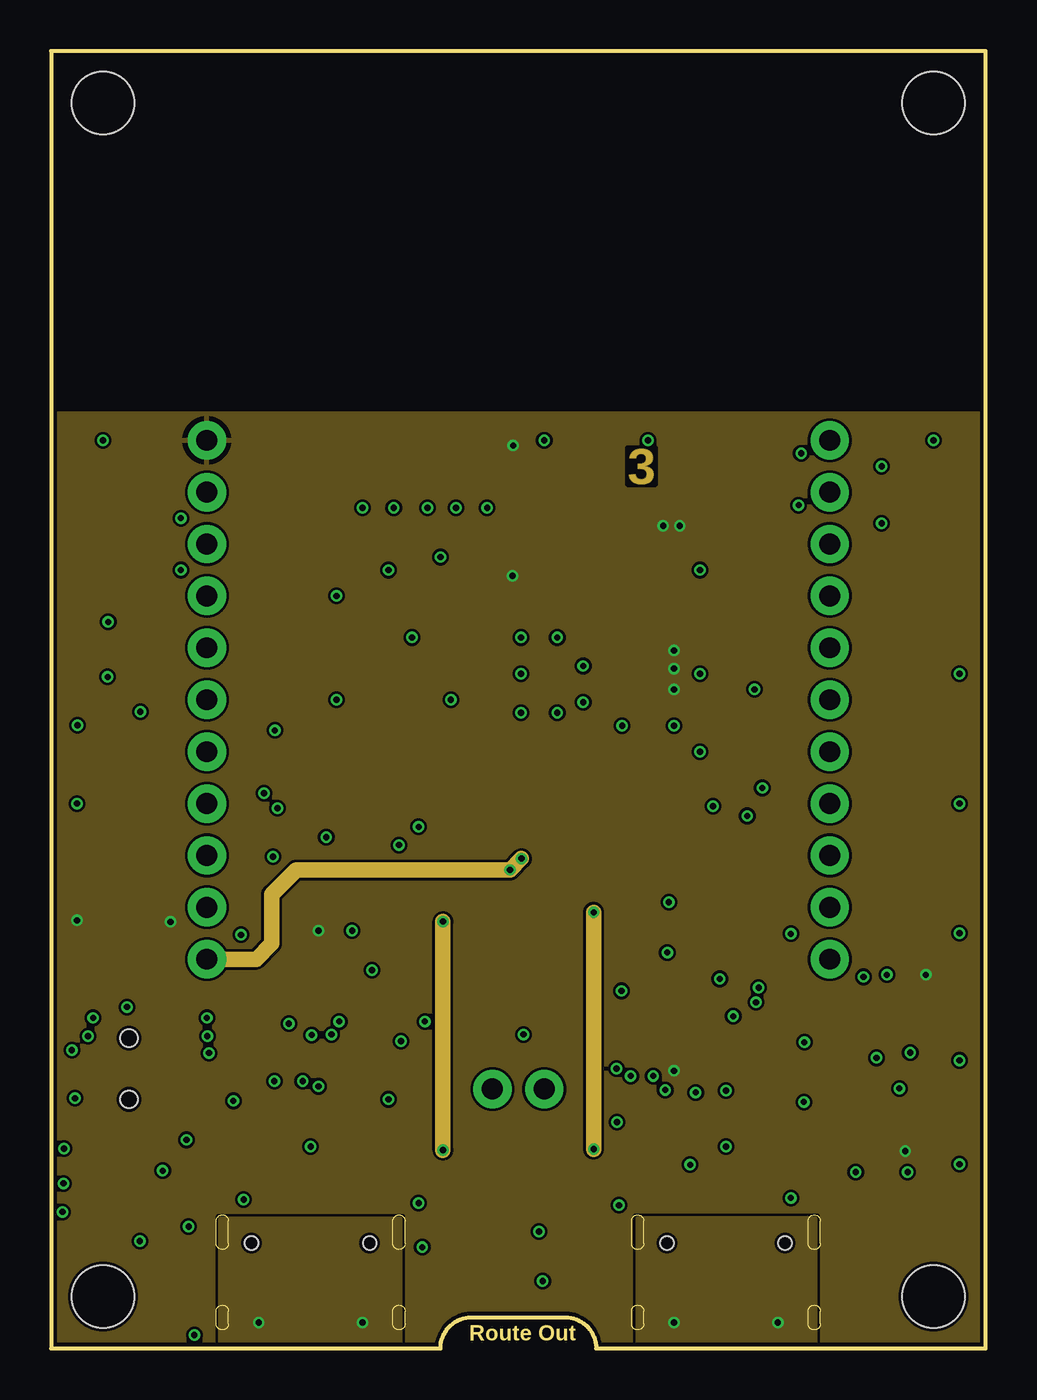
[diagram p3: board, inner layer Route15]
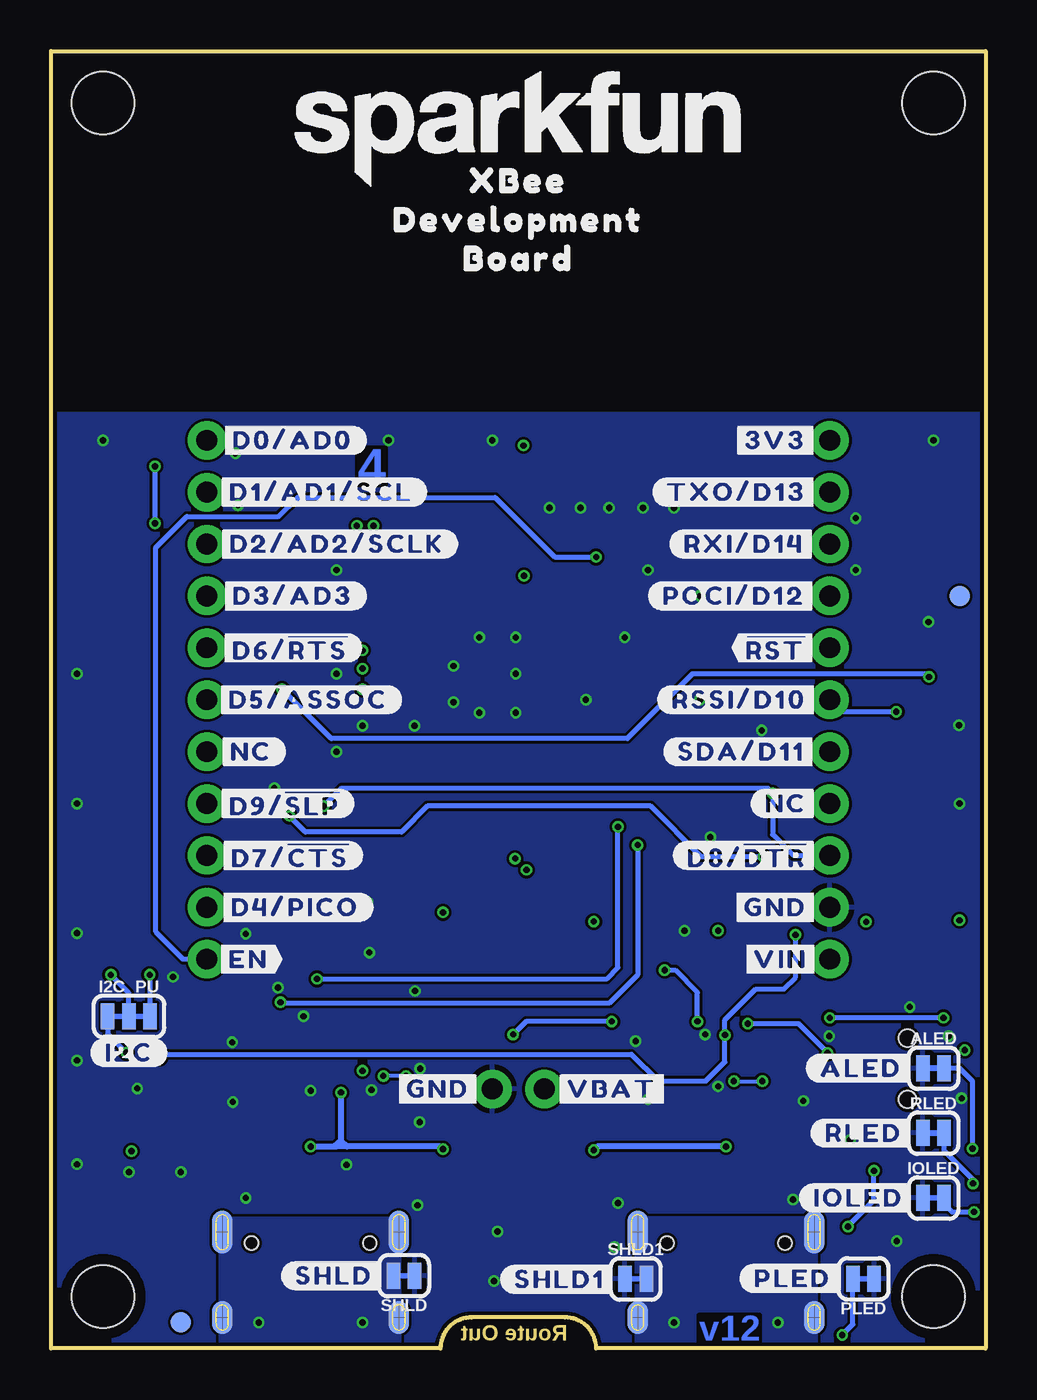
[diagram p4: board, bottom side, seen from below]

Size 45.72 x 63.5 mm. Coordinates in mm from the lower left corner, seen from the top.
Outline: 0,63.5 0,0 19.05,0 arc-90 20.57,1.52 25.15,1.52 arc-90 26.67,0 45.72,0 45.72,63.5 0,63.5
Copper layers (1*2*15*16): Top 0.035559375mm / dielectric 0.47751875mm / Route2 0.035559375mm / dielectric 0.47751875mm / Route15 0.035559375mm / dielectric 0.47751875mm / Bottom 0.035559375mm
Design rules "SparkFun-4-Layer-Minimum-JLCPCB": minimum track width 5mil, minimum drill 0.2mm, track to track 5mil, track to pad 5mil, pad to pad 5mil, via to via 5mil, smd to smd 5mil, copper to edge 7mil, drill to drill 7mil, minimum pad ring 5mil, minimum via ring 5mil, stop-mask expansion 2.5mil, vias tented up to drill 25mil, thermal gap 10mil
tRestrict: area 27.6,40.5 to 29.1,40.8; area 27.7,34.7 to 29,34.9

### Footprints (pad centres in the part's own frame; a part is rotated, then mirrored left to right if it is on the bottom)
SMT-JUMPER_2_NC_TRACE_SILK = smd 0.66 x 1.27: 1 -0.521,0; 2 0.521,0
1210 = smd 1.27 x 2.06: 1 -1.755,0; 2 1.755,0
0603 = smd 1.1 x 1: 1 -0.85,0; 2 0.85,0
SOD-323 = smd 0.63 x 0.83: A 1.15,0; C -1.15,0
LED-0603 = smd 1 x 1: A -0.877,0; C 0.877,0
SMA-DIODE = smd 1.27 x 1.47: A -2.15,0; C 2.15,0
USB-C-16P-4LAYER-ISOLATED = smd 0.3 x 1: A5 -1.25,-0.34; A6 -0.25,-0.34; A7 0.25,-0.34; A8 1.25,-0.34; B5 1.75,-0.34; B6 0.75,-0.34; B7 -0.75,-0.34; B8 -1.75,-0.34 | smd 0.6 x 1: GND -3.225,-0.34; GND2 3.225,-0.34; VBUS1 -2.45,-0.34; VBUS2 2.45,-0.34 | smd 1 x 2.1: SHLD1 -4.32,-0.915; SHLD2 4.32,-0.915 | smd 1 x 2.1 bottom: SHLD3 -4.32,-0.915; SHLD4 4.32,-0.915 | smd 1 x 1.6: SHLD5 -4.32,-5.095; SHLD8 4.32,-5.095 | smd 1 x 1.6 bottom: SHLD6 -4.32,-5.095; SHLD7 4.32,-5.095 | hole 0.65: -2.89,-1.445; 2.89,-1.445
FIDUCIAL-1X2 = smd 1 x 1: 1 0,0
STAND-OFF-TIGHT = hole 3.048: 0,0
SMT-JUMPER_3_2-NC_TRACE_SILK = smd 0.66 x 1.27: 1 -1.041,0; 2 0,0; 3 1.041,0
XBEE3-SMD = smd 1.7 x 0.85: 1 -12.5,11.11; 2 -9.5,9.11; 3 -12.5,7.11; 4 -9.5,5.11; 5 -12.5,3.11; 6 -9.5,1.11; 7 -12.5,-0.89; 8 -9.5,-2.89; 9 -12.5,-4.89; 10 -9.5,-6.89; 11 12.5,-6.89; 12 9.5,-4.89; 13 12.5,-2.89; 14 9.5,-0.89; 15 12.5,1.11; 16 9.5,3.11; 17 12.5,5.11; 18 9.5,7.11; 19 12.5,9.11; 20 9.5,11.11
JST04_1MM_RA = smd 0.6 x 1.35: 1 -1.5,0; 2 -0.5,0; 3 0.5,0; 4 1.5,0 | smd 1.2 x 2: NC1 2.8,-3.675; NC2 -2.8,-3.675
1X10_NO_SILK = drill 1.016 pad 1.88: 1 0,0; 2 2.54,0; 3 5.08,0; 4 7.62,0; 5 10.16,0; 6 12.7,0; 7 15.24,0; 8 17.78,0; 9 20.32,0; 10 22.86,0
JST-2-SMD = smd 1 x 4.6: 1 -1,-3.7; 2 1,-3.7 | smd 1.6 x 3.4: NC1 -3.4,1.5; NC2 3.4,1.5
1X01_NO_SILK_STAND = drill 1.016 pad 1.88: 1 0,0
1X02_NO_SILK = drill 1.016 pad 1.88: 1 0,0; 2 2.54,0
INDUCTOR_3.9UH = smd 4 x 1.6: P$1 0,-2; P$2 0,1.9
SOT23-3 = smd 0.8 x 0.9: 1 -0.95,-1; 2 0.95,-1; 3 0,1.1
TACTILE_SWITCH_SMD_5.2MM = smd 1.524 x 0.762: 1 -2.794,1.905; 2 2.794,1.905; 3 -2.794,-1.905; 4 2.794,-1.905
SWITCH_DPDT_SMD_AYZ0202 = smd 1 x 1.15: 1 -2.5,2.825; 2 0,2.825; 3 2.5,2.825; 4 -2.5,-2.825; 5 0,-2.825; 6 2.5,-2.825 | hole 0.85: 1.5,0; -1.5,0
MSOP10 = smd 1 x 0.3: 1 -2.25,1; 2 -2.25,0.5; 3 -2.25,0; 4 -2.25,-0.5; 5 -2.25,-1; 6 2.25,-1; 7 2.25,-0.5; 8 2.25,0; 9 2.25,0.5; 10 2.25,1
SOT23-6 = smd 0.55 x 1.35: 1 -0.95,-1.375; 2 0,-1.375; 3 0.95,-1.375; 4 0.95,1.375; 5 0,1.375; 6 -0.95,1.375
SOT-23-6 = smd 0.55 x 1.35: 1 -0.95,-1.375; 2 0,-1.375; 3 0.95,-1.375; 4 0.95,1.375; 5 0,1.375; 6 -0.95,1.375
SOT23-5 = smd 0.55 x 1.2: 1 -0.95,-1.3; 2 0,-1.3; 3 0.95,-1.3; 4 0.95,1.3; 5 -0.95,1.3
SSOP20_L = smd 0.381 x 1.143: 1 -2.857,-2.68; 2 -2.223,-2.68; 3 -1.587,-2.68; 4 -0.953,-2.68; 5 -0.318,-2.68; 6 0.318,-2.68; 7 0.953,-2.68; 8 1.587,-2.68; 9 2.223,-2.68; 10 2.857,-2.68; 11 2.857,2.68; 12 2.223,2.68; 13 1.587,2.68; 14 0.953,2.68; 15 0.318,2.68; 16 -0.318,2.68; 17 -0.953,2.68; 18 -1.587,2.68; 19 -2.223,2.68; 20 -2.857,2.68

### Placement (x,y rotation side)
ALED  2.54,13.72 0 bottom
C1  22.61,33.02 0 top
C2  28.45,31.9 180 top
C3  25.4,40.51 0 top
C4  28.45,33.4 180 top
C5  32.51,13.59 0 top
C6  4.83,35.56 180 top
C7  18.29,43.31 270 top
C8  22.86,18.03 270 top
C9  19.81,43.31 270 top
C10  21.34,43.31 270 top
C11  13.97,19.3 0 top
C12  15.24,43.31 270 top
C13  16.76,43.31 270 top
C14  32.26,21.97 180 top
C15  20.32,14.86 180 top
D1  20.32,22.86 180 top
D2  6.99,2.54 270 top
D3  2.29,8.76 180 top
D4  2.29,7.37 180 top
D5  25.4,22.86 0 top
D6  22.86,29.21 180 top
D7  25.27,14.86 180 top
D8  2.29,5.97 180 top
DIRECT_USB  12.7,6.6 0 top
FD1  1.27,36.83 0 top
FD2  1.27,36.83 0 bottom
FD3  39.37,1.27 0 top
FD4  39.37,1.27 0 bottom
FRAME1  -6.35,-33.02 0 top  (outside the outline)
H1  43.18,60.96 0 top
H2  43.18,2.54 0 top
H3  2.54,60.96 0 top
H4  2.54,2.54 0 top
I2C_PU  41.91,16.26 0 bottom
IOLED  2.54,7.37 0 bottom
J2  22.86,33.02 0 top
J4  40.64,10.16 90 top
J5  38.1,44.45 270 top
J6  7.62,44.45 270 top
J8  22.86,5.08 180 top
J9  7.62,19.05 90 top
J10  38.1,19.05 90 top
J12  24.13,12.7 180 top
L1  28.32,36.96 270 top
LOGO1  22.86,59.69 0 top
LOGO2  42.55,49.53 0 top
LOGO3  42.8,5.71 0 top
LOGO5  69.85,64.77 0 top  (outside the outline)
PLED  5.97,3.4 180 bottom
Q2  20.32,25.4 90 top
R1  1.27,19.05 270 top
R2  4.32,19.05 270 top
R3  19.05,36.83 270 top
R4  24.64,18.03 270 top
R5  13.97,17.78 180 top
R6  17.14,18.03 90 top
R7  28.96,10.16 270 top
R8  36.83,10.16 270 top
R9  8.13,10.16 270 top
R11  5.84,19.05 270 top
R12  2.79,19.05 270 top
R13  9.65,10.16 270 top
R14  40.51,16.38 90 top
R15  42.04,16.38 270 top
R16  16.51,10.16 270 top
R20  25.4,24.77 180 top
RLED  2.54,10.54 0 bottom
S1  3.17,41.91 90 top
S2  42.55,41.91 90 top
S3  3.81,13.69 270 top
SHLD  28.45,3.56 180 bottom
SHLD1  17.12,3.4 0 bottom
U1  12.95,14.86 0 top
U2  22.86,36.83 270 top
U3  12.7,10.16 180 top
U4  20.32,17.91 0 top
U5  33.02,10.16 180 top
U7  31.75,17.78 180 top
U$1  [#D2#AD2#SCLK#19]  31.75,39.37 0 bottom
U$2  [##RST##15]  4.95,34.29 0 top
U$3  [##CS##19]  40.13,36.83 0 top
U$4  [##CTS##25]  40.77,24.13 0 top
U$5  [##DTR##27]  4.95,24.13 0 top
U$6  [#D1#AD1#SCL#8]  32.51,41.91 0 bottom
U$7  [##RTS##24]  40.77,34.29 0 top
U$8  [#EN#17]  40.13,19.05 0 top
U$9  [#3V3#1]  7.62,47.12 270 top
U$10  [#D0#18]  38.1,46.61 90 top
U$11  [#VBAT#5]  18.29,12.7 0 top
U$12  [#D3#AD3#22]  33.91,36.83 0 bottom
U$13  [#D4#PICO#24]  33.78,21.59 0 bottom
U$14  [#POCI#D12#24]  12.32,36.83 0 bottom
U$15  [#TXO#D13#13]  12.19,41.91 0 bottom
U$16  [#RXI#D14#15]  11.81,39.37 0 bottom
U$17  [##RST##15]  10.29,34.29 0 bottom
U$18  [#RSSI#D10#17]  12.06,31.75 0 bottom
U$19  [CHG47]  25.15,16 0 top
U$20  [#GND#0]  26.8,12.7 0 top
U$21  [#EN#17]  36.07,19.05 0 bottom
U$22  [#SDA#D11#8]  11.94,29.21 0 bottom
U$23  [XBEE339]  22.86,57.15 0 top
U$24  [#NC#1]  35.94,29.21 0 bottom
U$25  [#GND#0]  4.95,21.59 0 top
U$26  [#I2C#33]  41.91,14.48 0 bottom
U$27  [#ALED#21]  6.1,13.72 0 bottom
U$28  [#PICO#23]  41.02,21.59 0 top
U$29  [#POCI#23]  4.78,36.83 0 top
U$30  [#RST#30]  3.43,46.48 0 top
U$31  [#RSSI#16]  4.83,31.75 0 top
U$32  [#DUSB#31]  7.75,14.99 0 top
U$33  [IO46]  5.18,5.99 0 top
U$34  [#SDA#7]  4.95,29.21 0 top
U$35  [#SHLD#740]  31.88,3.56 0 bottom
U$36  [#SHLD1#741]  20.83,3.38 0 bottom
U$37  [#VBAT#5]  18.29,12.7 0 bottom
U$38  [#GND#0]  26.8,12.7 0 bottom
U$39  [#D5#3]  40.13,31.75 0 top
U$40  [D03]  42.55,46.48 0 top
U$41  [#VIN#4]  10.03,19.05 0 top
U$42  [PWR26]  5.69,2.51 90 top
U$43  [ASC32]  5.41,8.89 0 top
U$44  [#3V3#1]  10.29,44.45 0 bottom
U$45  [#GND#0]  10.29,21.59 0 bottom
U$46  [#VIN#4]  10.03,19.05 0 bottom
U$47  [##SLP##27]  40.51,26.67 0 top
U$48  [#NC#3]  9.78,26.67 0 bottom
U$49  [#I2C#31]  7.11,12.45 0 top
U$50  [XBEE339]  22.86,57.15 0 bottom
U$51  [DEVELOPMENT1345]  22.86,55.24 0 top
U$52  [BOARD1346]  22.86,53.34 0 top
U$53  [#D8##DTR##27]  11.68,24.13 0 bottom
U$54  [#PLED#20]  9.45,3.43 0 bottom
U$55  [#D0#AD0#18]  33.91,44.45 0 bottom
U$56  [#D5#ASSOC#24]  33.15,31.75 0 bottom
U$57  [#D6##RTS##24]  34.04,34.29 0 bottom
U$58  [#D7##CTS##25]  34.04,24.13 0 bottom
U$59  [#IOLED#23]  6.22,7.37 0 bottom
U$60  [#D9##SLP##27]  34.29,26.67 0 bottom
U$61  [SFE_LOGO_FLAME_.2]  3.81,50.8 0 top
U$62  [RSSI31]  5.41,7.37 0 top
U$63  [SFE_LOGO_NAME_.2]  22.86,59.69 0 bottom
U$64  [#RLED#22]  5.97,10.54 0 bottom
U$65  [UART32]  33.02,7.49 0 top
U$66  [#NC#3]  5.46,26.67 0 top
U$67  [#NC#1]  40.26,29.21 0 top
U$68  [DIRECT_USB33]  12.7,7.62 0 top
U$70  [DEVELOPMENT1345]  22.86,55.24 0 bottom
U$71  [BOARD1346]  22.86,53.34 0 bottom
UART  33.02,6.6 0 top

### Tracks (layer width: path | path; a pad name or v marks a point on that pad's centre or on a via)
3.3V  (via drill 0.3)
  Top 0.254: R11.1 v5.84,20.88 | R1.1 v1.27,20.95
  Top 0.508: J4.2 v41.79,9.66 | U2.1 22.54,37.78 v22.58,37.82
  Top 0.762: J2.1 10.39,44.16 C12.1 C13.1 C7.1 C9.1 C10.1 22.57,44.16 v22.61,44.2
  Bottom 0.254: I2C_PU.2 41.91,17.4 v42.8,18.29
  other vias: 30.48,33.27 30.48,34.16 30.48,32.26 29.95,40.26 30.76,40.26 30.48,13.59 13.08,20.45
  pour Top (no thermals): 29.46,31.39 29.46,40.79 31.19,40.79 31.19,32.33 30.25,31.39
  pour Route15 (isolate 0.127, rank 3): 0,0 45.72,0 45.72,45.72 0,45.72
  pour Top (no thermals): 12.57,20.95 12.57,17.27 13.72,17.27 13.72,20.95
!RESET!
  Top 0.254: J2.5 10.36,36.07 9.91,36.07 8.13,34.29 J6.5 6.95,34.29 C6.1 5.68,37 4.45,38.23 1.78,38.23 1.27,38.73 S1.1 S1.2
ALED  (via drill 0.3)
  Top 0.254: D3.C 0.64,9.54 v0.64,9.78
  Bottom 0.254: v0.64,9.78 0.64,13.08 1.27,13.72 ALED.2
D0  (via drill 0.3)
  Top 0.254: J2.20 32.68,44.45 J5.1 40.64,44.45 | v40.64,43.18 40.64,44.45 | 40.64,44.45 S2.2 | v40.64,40.39 S2.1
  Bottom 0.254: v40.64,43.18 v40.64,40.39
D1/SCL
  Top 0.254: J2.19 37.88,42.13 J5.2 40.89,41.91 42.04,40.77 R15.1 42.79,16.48 42.79,12.95 41.51,11.66 J4.4
D2/SPI_CLK
  Top 0.254: J5.3 37.34,40.13 J2.18
D3/SPI_!CS!
  Top 0.254: J2.17 36.86,38.13 38.1,36.89 J5.4
D4/SPI_PICO  (via drill 0.3)
  Top 0.254: J5.10 38.1,21.84 35.36,24.58 J2.11 34.13,26.13 v34.06,26.06 | R9.1 8.13,14.11 8.26,14.24 8.26,16.77 9.91,18.41 9.91,23.24 10.79,24.13 v10.86,24.07
  Bottom 0.254: v10.86,24.07 13.91,24.07 16.38,26.54 27.3,26.54 28.57,25.27 33.27,25.27 v34.06,26.06
D5/ASSOCIATE  (via drill 0.3)
  Top 0.254: J5.6 38.1,31.82 35.79,34.13 J2.15 35.36,33.2 v34.42,32.26 | v2.77,32.87 2.77,19.93 R12.1
  Bottom 0.254: v2.77,32.87 2.92,33.02 14.35,33.02 17.53,29.84 32,29.84 v34.42,32.26
D6/!RTS!
  Top 0.254: J2.16 36.26,36.13 J5.5 39.88,32.51 39.88,21.05 39.23,20.4 37.41,20.4 36.07,19.05 34.54,19.05 33.97,19.62 U7.2
D7/!CTS!
  Top 0.254: J5.9 36.7,25.53 36.7,26.54 35.12,28.13 J2.12 32.36,28.07 30.86,28.07 29.53,26.73 U7.9
D8/!DTR!  (via drill 0.3)
  Top 0.254: v10.41,27.18 10.36,27.23 J2.9 | U7.1 34.61,23.94 32.38,26.16 v32.38,26.54
  Bottom 0.254: J6.9 9.4,24.13 10.41,25.15 v10.41,27.18 10.67,27.43 31.5,27.43 v32.38,26.54
D9/!SLEEP!
  Top 0.254: J5.8 38.1,27.39 37.63,27.86 36.53,27.86 35.36,29.03 J2.13
D10/RSSI_PWM  (via drill 0.3)
  Top 0.254: J6.6 8.89,33.02 10,34.13 J2.6 | v4.37,31.17 4.28,31.08 4.28,19.94 R2.1
  Bottom 0.254: J6.6 7.04,31.17 v4.37,31.17
D11/SDA  (via drill 0.3)
  Top 0.254: U1.2 12.73,15.36 v12.75,15.34 | v9.3,20.24 9.3,27.53 J6.7 | J4.3 39.89,10.66 39.62,10.92 39.62,12.83 40.39,13.59 v40.39,14.22 40.39,15.41 R14.1
  Bottom 0.254: v9.3,20.24 9.3,18.16 9.87,17.59 11.24,17.59 12.75,16.08 v12.75,15.34 12.75,14.02 13.68,13.09 16.02,13.09 17.32,14.4 40.21,14.4 v40.39,14.22
D12/SPI_POCI
  Top 0.254: J2.4 8.92,38.13 J6.4
D13/TXO  (via drill 0.3)
  Top 0.254: v17.98,25.53 17.98,33.33 15.85,35.46 15.85,39.19 13.36,41.68 J2.2 7.84,42.13 J6.2 | U7.4 32.7,18.1 v32.72,18.09
  Bottom 0.254: v17.98,25.53 17.98,18.64 18.54,18.09 v32.72,18.09
D14/RXI  (via drill 0.3)
  Top 0.254: v17.02,24.64 17.02,32.99 14.99,35.03 14.99,38.71 13.57,40.13 10.16,40.13 | J6.3 8.38,40.13 10.16,40.13 | J2.3 10.16,40.13 | U7.20 34.61,16.83 v34.49,16.94 | 10.16,40.13
  Bottom 0.254: v34.49,16.94 34.49,16.92 18.39,16.92 17.03,18.28 v17.03,24.63 v17.02,24.64
D+
  Top 0.203: UART.A6 32.77,5.58 33.02,5.33 33.53,5.33 33.77,5.58 UART.B6 33.77,7.61 33.97,7.81 U5.6 33.97,9.72 33.27,10.41 31.45,10.41 28.89,12.97 U7.11
D-  (via drill 0.3)
  Top 0.203: UART.B7 32.27,7.49 | 32.27,7.49 32.27,7.64 32.07,7.84 U5.4 32.05,8.81 32.05,9.31 28.36,13 v28.36,13.34 | UART.A7 33.27,7.24 33.02,7.49 32.27,7.49 | v29.46,13.34 29.46,15.04 U7.12
  Bottom 0.203: v28.36,13.34 v29.46,13.34
DIRECT_D+
  Top 0.203: DIRECT_USB.A6 12.45,5.69 12.7,5.44 13.21,5.44 13.45,5.68 DIRECT_USB.B6 13.45,7.48 13.65,7.68 U3.6 13.65,9.78 13.02,10.41 11.33,10.41 11.05,10.69 11.05,12.45 11.79,13.18 11.79,14.66 11.58,14.86 U1.3
DIRECT_D-  (via drill 0.3)
  Top 0.203: U1.7 12.3,14.36 12.14,14.2 12.14,13.25 v12.31,13.08 | DIRECT_USB.B7 11.95,7.37 | 11.95,7.37 11.95,7.82 11.75,8.02 U3.4 11.75,9.21 10.69,10.27 10.69,12.85 v10.92,13.08 | 11.95,7.37 12.7,7.37 12.95,7.12 DIRECT_USB.A7
  Bottom 0.203: v12.31,13.08 v10.92,13.08
DIRECT_SELECT  (via drill 0.3)
  Top 0.254: v11.63,15.9 11.63,15.86 U1.1 | v1.02,14.61 0.98,14.57 S3.5 | S3.2 7.42,13.69 7.73,14 v7.73,14.46
  Route2 0.254: v1.02,14.61 1.08,14.61 1.22,14.46 v7.73,14.46
  Bottom 0.254: v11.63,15.9 9.17,15.9 v7.73,14.46
EN  (via drill 0.3)
  Top 0.254: U2.2 20.7,36.83 19.85,37.68 R3.1 v19.05,38.73
  Bottom 0.254: J10.1 39.24,19.05 40.59,20.4 40.59,39.2 39.08,40.72 34.6,40.72 33.66,41.66 24,41.66 21.07,38.73 v19.05,38.73
FIRMWARE  (via drill 0.3)
  Top 0.254: R1.2 1.27,17.44 0.98,17.15 S3.4 2.05,16.19 v2.06,16.18 | v7.62,16.18 v7.61,16.19 S3.1
  Bottom 0.254: v2.06,16.18 v7.62,16.18
GND  (via drill 0.3)
  Top 0.254: U1.9 v13.72,15.36 v13.72,15.37 | DIRECT_USB.GND2 15.93,6.92 16.15,7.14 17.95,7.14 v17.98,7.11 | C15.2 20.32,15.71 U4.2
  Top 0.762: J8.1 23.86,12.43 J12.1
  other vias: 19.56,31.75 36.83,12.06 15.24,41.15 8.92,12.12 26.04,33.4 26.04,31.62 41.91,8.64 39.37,8.64 16.51,12.19 17.65,34.8 16.76,41.15 18.41,41.15 23.88,5.71 39.75,18.19 36.7,43.81 44.45,33.02 44.45,26.67 44.45,20.32 44.45,14.1 24.05,3.3 1.27,26.67 36.58,41.27 13.46,25.02 34.8,27.43 2.54,44.45 6.63,10.21 1.17,12.24 1.8,15.29 7.65,15.29 44.45,9.02 1.3,30.51 29.21,44.45 24.13,44.45 3.71,16.71 41.5,12.73 43.18,44.45 18.16,4.95 19.81,41.15 21.34,41.15 16.51,38.1 31.75,38.1 31.75,33.02 31.75,29.21 13.97,31.75 13.97,36.83 24.77,34.8 24.77,31.11 22.99,33.02 22.99,31.11 6.35,38.1 6.35,40.64 30.23,21.84 27.91,17.5 30.15,19.38 33.38,16.26 34.62,17.65 14.73,20.45 13.08,12.83 33.02,12.62 27.69,11.07 31.27,8.99 36.2,7.37 27.79,7.01 9.42,7.29 36.86,14.99 17.12,15.04 27.66,13.69 30.05,12.65 11.07,26.44 2.79,35.56 10.95,30.25 22.99,34.8 4.34,5.26 27.94,30.48 30.48,30.48 36.2,20.29
  pour Top (isolate 0.127, rank 3): 0,0 45.72,0 45.72,45.72 0,45.72
  pour Route2 (isolate 0.127, rank 3): 0,0 45.72,0 45.72,45.72 0,45.72
  pour Bottom (isolate 0.127, rank 3): 0,0 45.72,0 45.72,45.72 0,45.72
  pour Top (no thermals): 19.08,15.34 19.81,15.34 20.04,15.57 20.09,15.62 20.09,17.14 20.12,17.17 20.57,17.17 20.57,15.6 20.17,15.19 20.17,14.43 18.97,14.43 18.97,15.34 19.05,15.34
IOLED  (via drill 0.3)
  Top 0.254: v0.56,6.68 0.7,6.68 D8.C
  Bottom 0.254: IOLED.2 2.02,7.06 1.64,6.68 v0.56,6.68
N$1
  Top 0.254: C3.1 24.55,38.98 24.23,38.67 U2.6
N$2
  Top 0.254: R2.2 4.32,17.08 4.77,16.62 4.77,8.97 D4.A
N$3  (via drill 0.3)
  Top 0.254: U1.10 14.24,15.86 v14.1,16 | R5.1 15.54,17.78 15.7,17.93 v15.7,18.52
  Bottom 0.254: v14.1,16 14.1,17.42 15.19,18.52 v15.7,18.52
N$4
  Top 0.254: UART.B5 34.77,8.46 35.62,9.31 R8.2
N$5
  Top 0.254: UART.A5 31.77,7.6 30.06,9.31 R7.2
N$6
  Top 0.254: R6.2 18.16,18.88 18.48,19.21 U4.5
N$7  (via drill 0.3)
  Top 0.254: R11.2 5.84,17.18 5.46,16.8 v5.46,8.7 | D2.A 6.99,5.71 v6.73,5.97
  Bottom 0.254: v6.73,5.97 5.46,7.24 v5.46,8.7
N$8
  pour Top (no thermals): 23.88,37.08 25.4,37.08 25.4,41.27 27.18,41.27 27.18,34.92 25.53,34.92 25.53,36.58 23.88,36.58
N$9  (via drill 0.3)
  Top 0.254: U4.1 19.37,16.23 19.15,16 v18.29,16 | v23.11,15.37 23.62,14.86 D7.C
  Bottom 0.254: v18.29,16 22.48,16 v23.11,15.37
N$10
  Top 0.254: R4.2 25.49,17.18 26.15,16.52 D7.A
N$11  (via drill 0.3)
  Top 0.254: v40.89,18.29 40.81,18.29 40.51,18 R14.2
  Bottom 0.254: I2C_PU.3 40.87,18.26 v40.89,18.29
N$12
  Top 0.254: R12.2 2.79,16.8 3.06,16.54 3.06,8.87 D3.A
N$13  (via drill 0.3)
  Top 0.254: R15.2 v42.04,14.48
  Bottom 0.254: I2C_PU.1 42.95,15.39 v42.04,14.48
N$14
  Top 0.254: DIRECT_USB.B5 14.45,8.76 15,9.31 R16.2
N$15
  pour Top (no thermals): 18.54,36.45 19.68,36.45 20.07,36.07 22.1,36.07 22.1,26.29 21.72,25.91 20.95,25.91 20.07,26.8 20.07,33.91 18.54,35.43
N$16
  Top 0.254: DIRECT_USB.A5 11.45,7.6 11.05,8 10.16,8 9.65,8.51 R13.2
N$17
  Top 0.254: D8.A 5.71,5.97 6.6,6.86 6.6,8.89 7.02,9.31 R9.2
N$18
  Top 0.305: 32.07,15.24 U7.16 32.07,16.19 31.97,16.29 | 30.86,16.51 30.35,16.51 30.16,16.32 U7.13 | 30.86,16.51 31.5,16.51 | 31.5,16.51 31.75,16.51 31.97,16.29 | U7.14 30.8,16.45 30.86,16.51 | 31.97,16.29 33.27,17.6 33.34,17.67 U7.3 33.34,21.74 C14.1 | U7.6 31.43,16.57 31.5,16.51
PLED  (via drill 0.3)
  Top 0.254: D2.C 7.01,1.64 v7.01,0.66
  Bottom 0.254: v7.01,0.66 6.49,1.18 PLED.2
RLED  (via drill 0.3)
  Top 0.254: D4.C 1.32,7.37 v0.61,8.08
  Bottom 0.254: v0.61,8.08 0.61,8.25 2.02,9.66 RLED.2
SHLD  (via drill 0.3)
  other vias: 30.48,1.27 35.56,1.27
  pour Top (rank 2, no thermals): 28.68,6.35 28.68,0 37.39,0 37.39,6.35
  pour Bottom (rank 2, no thermals): 28.7,6.35 28.7,0 37.39,0 37.39,6.35
  pour Route2 (rank 2, no thermals): 28.7,6.35 28.7,0 37.39,0 37.39,6.35
  pour Route15 (rank 2, no thermals): 28.7,6.35 28.7,0 37.39,0 37.39,6.35
SHLD1  (via drill 0.3)
  other vias: 10.16,1.27 15.24,1.27
  pour Top (rank 2): 8.31,6.35 8.31,0 17.07,0 17.07,6.35
  pour Bottom (rank 2, no thermals): 17.07,6.35 17.07,0 8.31,0 8.31,6.35
  pour Route15 (rank 2): 17.07,6.35 17.07,0 8.31,0 8.31,6.35
  pour Route2 (rank 2): 17.07,6.35 17.07,0 8.31,0 8.31,6.35
V_BATT
  Top 0.559: Q2.3 19.35,25.4 20.32,24.43 20.32,18.57 21.25,17.63 21.25,16.62 U4.3 21.27,14.96 C15.1 21.59,14.44 J12.2 21.86,12.43 J8.2
V_USB  (via drill 0.3)
  Top 0.254: 31.52,13.74 C5.1
  Top 0.305: U5.5 v33.02,9.88 | U7.15 31.43,13.82 31.52,13.74 31.54,13.71 v31.54,12.53
  Top 0.559: UART.VBUS1 30.57,7.53
  Top 0.762: D5.A v26.55,21.34
  Top 0.889: 30.57,7.53 30.12,7.98 27.27,7.98 26.55,8.69 v26.55,9.75
  Route15 0.762: v26.55,9.75 v26.55,21.34
  Bottom 0.305: 31.24,9.88 26.68,9.88 v26.55,9.75 | 31.24,9.88 31.75,9.88 | 31.75,9.88 31.54,10.09 31.54,10.16 | v31.54,12.53 31.54,10.16 | v33.02,9.88 31.88,9.88 | 31.88,9.88 31.75,9.88 | 31.54,10.16 31.24,9.88 | 31.54,10.16 31.88,9.88
  pour Top (no thermals): 30.48,6.73 30.48,5.59 32.13,3.94 34.04,3.94 35.56,5.46 35.56,6.6 35.43,6.73
V_USB_2  (via drill 0.3)
  Top 0.305: v12.7,9.88 U3.5
  Top 0.559: DIRECT_USB.VBUS2 15.15,7.53
  Top 0.762: D1.A v19.17,20.9
  Top 0.889: 15.15,7.53 15.62,8 18.29,8 19.17,8.88 v19.17,9.7
  Route15 0.762: v19.17,9.7 v19.17,20.9
  Bottom 0.305: v12.7,9.88 18.99,9.88 v19.17,9.7
  pour Top (no thermals): 10.16,6.73 10.16,5.59 11.81,3.94 13.72,3.94 15.24,5.46 15.24,6.6 15.11,6.73
VIN  (via drill 0.3)
  Top 0.762: D1.C 21.47,20.84 21.27,20.64 U4.4 | C8.1 R4.1
  Route15 0.762: J9.1 10.03,19.05 10.79,19.81 10.79,22.23 11.99,23.42 v22.45,23.42 v23.01,23.98
  pour Top (isolate 0.305, no thermals): 21.21,22.35 24.64,22.35 25.15,22.86 25.15,26.42 26.16,27.43 26.16,30.1 23.88,30.1 23.88,26.04 22.73,24.89 20.83,24.89 20.83,22.73
  pour Top (no thermals): 21.08,19.56 21.08,19.05 21.46,18.67 21.72,18.41 23.37,18.41 23.37,19.81 21.08,19.81 21.08,19.68
XBEE_D+/SDA
  Top 0.203: J2.7 11.05,32.13 11.05,31.95 11.68,31.32 11.68,17.22 10.97,16.51 10.06,16.51 9.65,16.1 9.65,14.61 9.9,14.36 U1.4
XBEE_D-
  Top 0.203: U1.6 16.02,13.86 16.38,14.22 16.38,16.08 15.82,16.64 12.68,16.64 12.1,17.21 12.1,29.38 12.85,30.13 J2.8

### Text on the board
Top: 1
Route2: 2
Route15: 3
Bottom: 4 | v12
Milling: Route Out
Measures: Units in Inches
tDocu: FOUR LAYER BOARD | 1.6mm Thickness | LEAD-FREE HASL | 1oz Outer Layer / 0.5oz Inner Layer / JLC0416H-7628 Stackup | Elias Santistevan